# Altium schematic sheet Sheet1.SchDoc
size A4
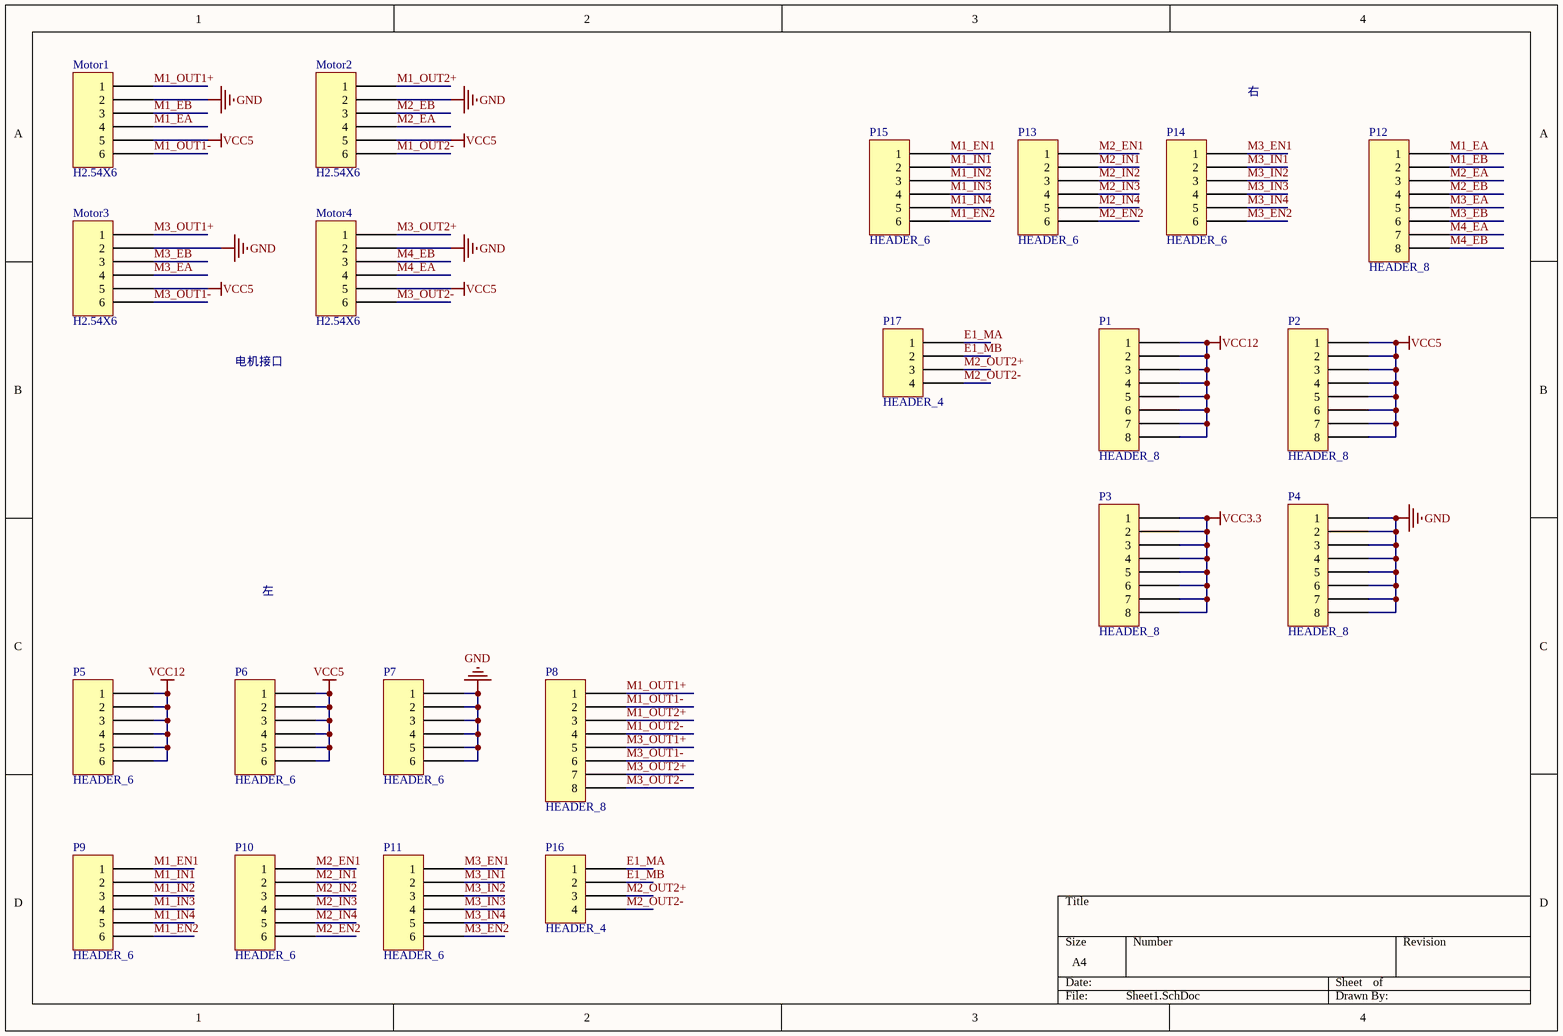
[diagram p0: Sheet1.SchDoc]

## Parts
Motor1  H2.54X6  [Header6]
Motor2  H2.54X6  [Header6]
Motor3  H2.54X6  [Header6]
Motor4  H2.54X6  [Header6]
P1  HEADER_8  [HDR1X8]
P2  HEADER_8  [HDR1X8]
P3  HEADER_8  [HDR1X8]
P4  HEADER_8  [HDR1X8]
P5  HEADER_6  [HDR1X6]
P6  HEADER_6  [HDR1X6]
P7  HEADER_6  [HDR1X6]
P8  HEADER_8  [HDR1X8]
P9  HEADER_6  [HDR1X6]
P10  HEADER_6  [HDR1X6]
P11  HEADER_6  [HDR1X6]
P12  HEADER_8  [HDR1X8]
P13  HEADER_6  [HDR1X6]
P14  HEADER_6  [HDR1X6]
P15  HEADER_6  [HDR1X6]
P16  HEADER_4  [HDR1X4]
P17  HEADER_4  [HDR1X4]

## Nets
GND: Motor1.2 Motor2.2 Motor3.2 Motor4.2 P4.1 P4.2 P4.3 P4.4 P4.5 P4.6 P4.7 P4.8 P7.1 P7.2 P7.3 P7.4 P7.5 P7.6
VCC3.3: P3.1 P3.2 P3.3 P3.4 P3.5 P3.6 P3.7 P3.8
VCC5: Motor1.5 Motor2.5 Motor3.5 Motor4.5 P2.1 P2.2 P2.3 P2.4 P2.5 P2.6 P2.7 P2.8 P6.1 P6.2 P6.3 P6.4 P6.5 P6.6
VCC12: P1.1 P1.2 P1.3 P1.4 P1.5 P1.6 P1.7 P1.8 P5.1 P5.2 P5.3 P5.4 P5.5 P5.6
E1_MA: P16.1 P17.1
E1_MB: P16.2 P17.2
M1_EA: Motor1.4 P12.1
M1_EB: Motor1.3 P12.2
M1_EN1: P9.1 P15.1
M1_EN2: P9.6 P15.6
M1_IN1: P9.2 P15.2
M1_IN2: P9.3 P15.3
M1_IN3: P9.4 P15.4
M1_IN4: P9.5 P15.5
M1_OUT1+: Motor1.1 P8.1
M1_OUT1-: Motor1.6 P8.2
M1_OUT2+: Motor2.1 P8.3
M1_OUT2-: Motor2.6 P8.4
M2_EA: Motor2.4 P12.3
M2_EB: Motor2.3 P12.4
M2_EN1: P10.1 P13.1
M2_EN2: P10.6 P13.6
M2_IN1: P10.2 P13.2
M2_IN2: P10.3 P13.3
M2_IN3: P10.4 P13.4
M2_IN4: P10.5 P13.5
M2_OUT2+: P16.3 P17.3
M2_OUT2-: P16.4 P17.4
M3_EA: Motor3.4 P12.5
M3_EB: Motor3.3 P12.6
M3_EN1: P11.1 P14.1
M3_EN2: P11.6 P14.6
M3_IN1: P11.2 P14.2
M3_IN2: P11.3 P14.3
M3_IN3: P11.4 P14.4
M3_IN4: P11.5 P14.5
M3_OUT1+: Motor3.1 P8.5
M3_OUT1-: Motor3.6 P8.6
M3_OUT2+: Motor4.1 P8.7
M3_OUT2-: Motor4.6 P8.8
M4_EA: Motor4.4 P12.7
M4_EB: Motor4.3 P12.8

## Notes on the sheet
- 右
- 电机接口
- 左